# Altium project Portier_1730.PrjPcb
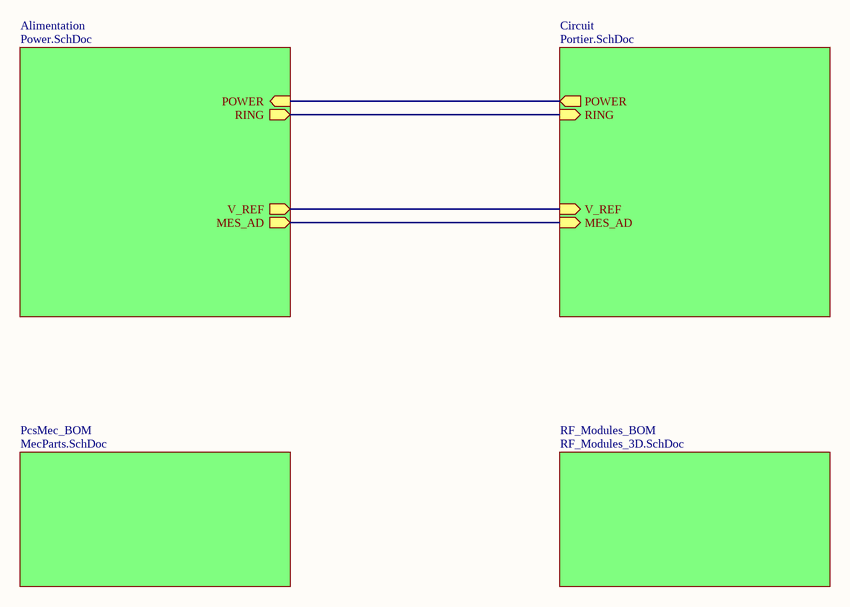
[diagram p0: TopSchematic.SchDoc]
5 sheets, 81 parts. Net scope: hierarchical (ports join the sheet entries above them; power ports are global).
Board file: Portier.PcbDoc
Sheets:
  TopSchematic.SchDoc
    Alimentation = Power.SchDoc
    Circuit = Portier.SchDoc
    PcsMec_BOM = MecParts.SchDoc
    RF_Modules_BOM = RF_Modules_3D.SchDoc

## Sheet TopSchematic.SchDoc: Top Schematic
size A4; Author: SCA/JMO; DrawnBy: IPE; Engineer: IPE; Address1: ETML-ES; Address2: Rue de Sébeillon 12; Address3: 1004 Lausanne; Revision: 17300C; SheetNumber: 3; SheetTotal: 3; Version: C; Modifc: Voir 17300_Portier-MOD-v_B.docx

### Sub-sheets
Alimentation = Power.SchDoc: RING (out), POWER (in), V_REF (out), MES_AD (out)
Circuit = Portier.SchDoc: MES_AD (in), V_REF (in), RING (in), POWER (out)
PcsMec_BOM = MecParts.SchDoc: no entries
RF_Modules_BOM = RF_Modules_3D.SchDoc: no entries

### Nets
NetC100_1: sheet Alimentation/RING, sheet Circuit/RING
NetC102_2: sheet Alimentation/V_REF, sheet Circuit/V_REF
NetQ102_1: sheet Alimentation/POWER, sheet Circuit/POWER
NetR103_1: sheet Alimentation/MES_AD, sheet Circuit/MES_AD

### Notes on the sheet
- Fichier :
- a
- Date :
- Heure :
- Version :
- Auteur :
- Modif.
- b
- c
- d
- Projet :
- No :
- Nb feuilles
- Feuille n°
- Chemin :

## Sheet Power.SchDoc: Power
size A4; Author: SCA/JMO; DrawnBy: IPE; Engineer: IPE; Address1: ETML-ES; Address2: Rue de Sébeillon 12; Address3: 1004 Lausanne; Revision: 17300C; SheetNumber: 1; SheetTotal: 3; Version: C; Modifc: Voir 17300_Portier-MOD-v_B.docx
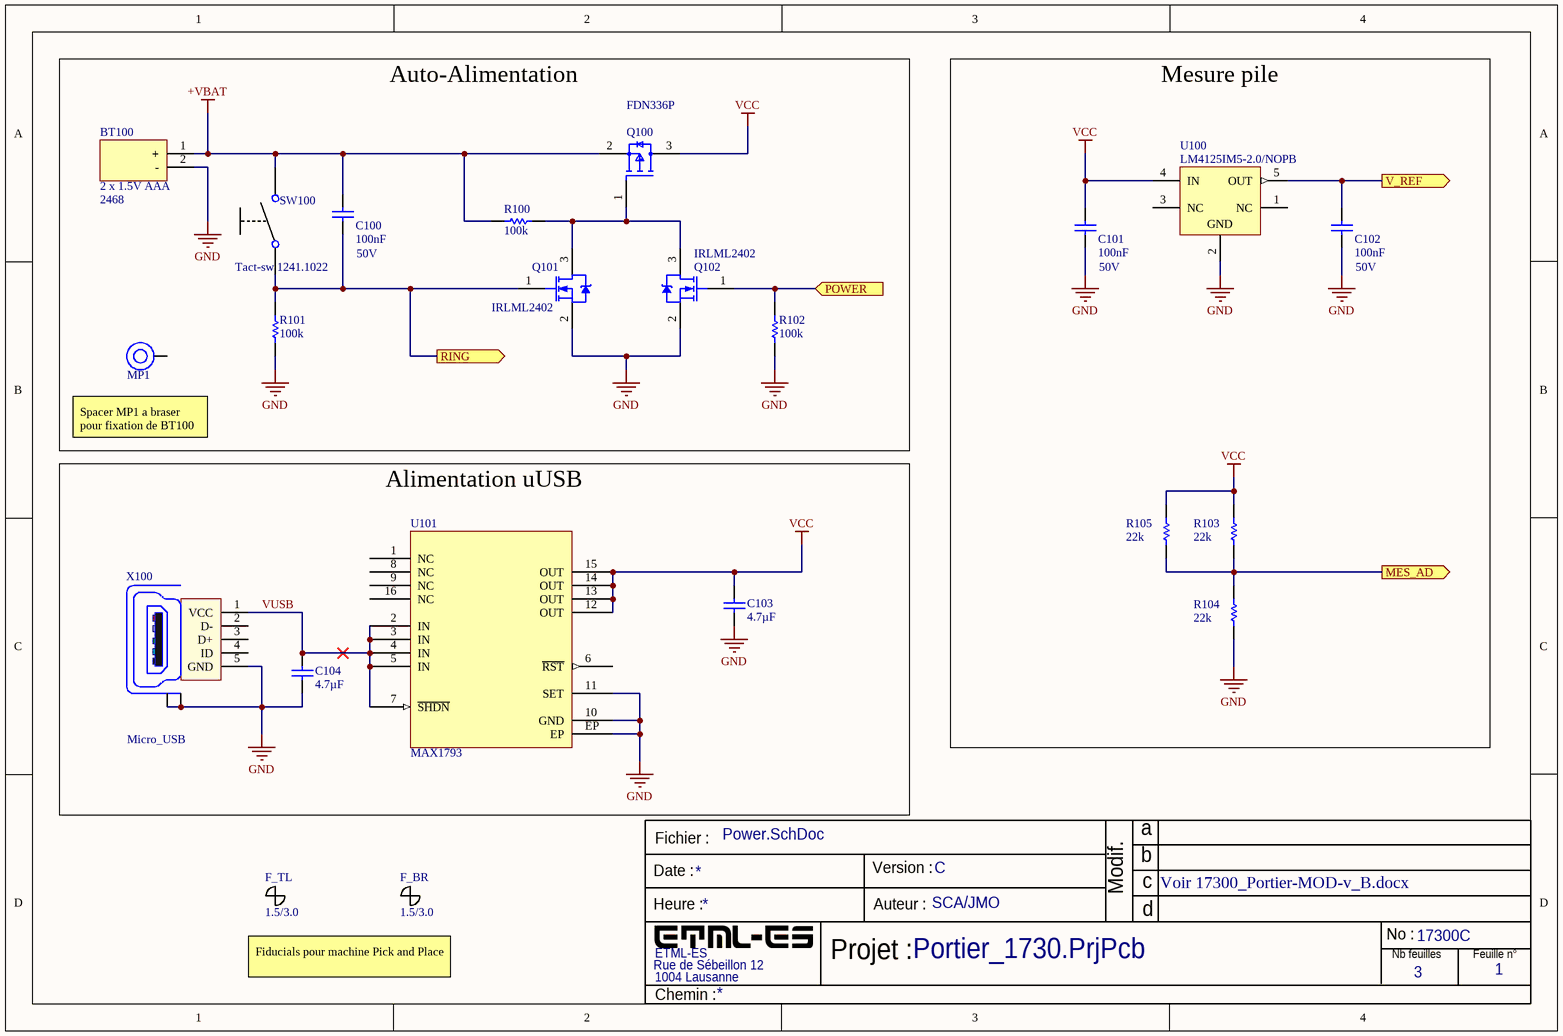
[diagram p1: Power.SchDoc]

### Parts
BT100  2 x 1.5V AAA  [2468_3D_Keystone]
C100  100nF  Rated Voltage (DC): 50V  [WCAP-CSGP_0805_L2W1.25H0.8_Reflow]
C101  100nF  Rated Voltage (DC): 50V  [WCAP-CSGP_0805_L2W1.25H0.8_Reflow]
C102  100nF  Rated Voltage (DC): 50V  [WCAP-CSGP_0805_L2W1.25H0.8_Reflow]
C103  4.7µF  [WCAP-CSGP_0805_L2W1.25H1.25]
C104  4.7µF  [WCAP-CSGP_0805_L2W1.25H1.25]
F_BR  1.5/3.0  [FID-150-300]  (no BOM)
F_TL  1.5/3.0  [FID-150-300]  (no BOM)
MP1  M3 x 3mm  [9774030360]  (value not drawn)
Q100  FDN336P  [FP-527AG-IPC_A]
Q101  IRLML2402  [INTR-IRLML2402TRPBF-3_V]
Q102  IRLML2402  [INTR-IRLML2402TRPBF-3_V]
R100  100k  [RESC2013X70X40ML20T20]
R101  100k  [RESC2013X70X40ML20T20]
R102  100k  [RESC2013X70X40ML20T20]
R103  22k  [RESC2013X50X30NL20T20]
R104  22k  [RESC2013X50X30NL20T20]
R105  22k  [RESC2013X50X30NL20T20]
SW100  Tact-sw 1241.1022  [Tact-sw 1241.1022]
U100  LM4125IM5-2.0/NOPB  [DBV0005A_M]
U101  MAX1793  [TSOP65P640X110_HS-17N]
X100  Micro_USB  [Micro_USB]

### Ports
MES_AD (out), POWER (in), RING (out), V_REF (out)

### Nets
+VBAT: BT100.1(+) C100.2 Q100.2(S) R100.2 SW100.2
GND: BT100.2(-) C101.1 C102.1 C103.1 C104.1 Q101.2(S) Q102.2(S) R101.1 R102.1 R104.1 U100.2(GND) U101.10(GND) U101.11(SET) U101.EP X100.5(GND) X100.Z1(Shield) X100.Z2(Shield)
VCC: C101.2 C103.2 Q100.3(D) R103.2 R105.2 U100.4(IN) U101.12(OUT) U101.13(OUT) U101.14(OUT) U101.15(OUT)
VUSB: C104.2 U101.2(IN) U101.3(IN) U101.4(IN) U101.5(IN) U101.7(~{SHDN}) X100.1(VCC)
NetC100_1: C100.1 Q101.1(G) R101.2 SW100.1 ; port RING
NetC102_2: C102.2 U100.5(OUT) ; port V_REF
NetQ100_1: Q100.1(G) Q101.3(D) Q102.3(D) R100.1
NetQ102_1: Q102.1(G) R102.2 ; port POWER
NetR103_1: R103.1 R104.2 R105.1 ; port MES_AD

Not connected (* = marked no-connect by the designer): MP1 1; U100 1(NC) 3(NC); U101 1(NC) 6(~{RST}) 8(NC) 9(NC) 16(NC); X100 2(D-) 3(D+) 4(ID)

### Notes on the sheet
- Auto-Alimentation
- (near MP1) Spacer MP1 a braser pour fixation de BT100
- Mesure pile
- Alimentation uUSB
- Fiducials pour machine Pick and Place
- Fichier :
- a
- Date :
- Heure :
- Version :
- Auteur :
- Modif.
- b
- c
- d
- Projet :
- No :
- Nb feuilles
- Feuille n°
- Chemin :

### Library data of the parts
BT100 = 2468: Cylindrical Battery Contacts, Clips, Holders & Springs 2AAA PC MNT HOLDER; Manufacturer_Name: Keystone Electronics; Manufacturer_Part_Number: 2468; Mouser Part Number: 534-2468; Mouser Price/Stock: https://www.mouser.co.uk/ProductDetail/Keystone-Electronics/2468?qs=3CbvriavsLAoISGi3MywrQ%3D%3D; Arrow Part Number: 2468; Arrow Price/Stock: http://www.arrow.com/en/products/2468/keystone-electronics-corp; Mouser Testing Part Number: *; Mouser Testing Price/Stock: *; Datasheet Link: https://datasheet.datasheetarchive.com/originals/distributors/Datasheets-AE/DSA3AE00005.pdf; Value: 2 x 1.5V AAA
C100-C102 = 885012207098: WCAP-CSGP Multilayer Ceramic Chip Capacitor, General Purpose, size 0805, X7R, 100nF, 50VDC; Manufacturer: Wurth Elektronik; Capacitance Tolerance: +/-10%; Case/Size Code: 0805; Dissipation Factor: 2.5%; Insulation Resistance: 5GΩ; Technical Reference: X7R0805104K050DFCT10000; Length: 2mm; ComponentLink1Description: Website Link; Width: 1.25mm; Capacitance: 100nF; ComponentLink1URL: https://www.we-online.com/redexpert/article/885012207098?ad; Mount: Surface Mount; ComponentLink2URL: https://www.we-online.com/redexpert/spec/885012207098?ad; ComponentLink2Description: Datasheet Link; Packaging: Tape and Reel; Height: 0.8mm; Category: Multilayer Ceramic Chip Capacitors; Ceramic Type: X7R; Manufacturer Part Number: 885012207098; Match Code: WCAP-CSGP; Operating Temperature Max: 125°C; Operating Temperature Min: -55°C
C103 C104 = 885012207053: WCAP-CSGP Multilayer Ceramic Chip Capacitor, General Purpose, size 0805, X7R, 4.7µF, 16VDC; PartNumber: GRM21BR61C475KA88L; Manufacturer: Wurth Elektronik; Tolerance: 10%; Voltage Rating (DC): 16 V; Capacitance Tolerance: +/-10%; Case/Size Code: 0805; Insulation Resistance: 0.02GΩ; Rated Voltage (DC): 16V; Technical Reference: X7R0805475K016DFCT10000; Value: 4.7µF 16V; DatasheetVersion: 03/2016; Width: 1.25mm; Capacitance: 4.7µF; Mount: Surface Mount; ComponentLink1Description: Website Link; Case Code (Metric): 2012; PackageDescription: 2-Pin Surface Mount Device, Body 2 x 1.25 mm; Height: 1.25mm; Voltage Rating: 16 V; Max Operating Temperature: 85 degC; Length: 2mm; ComponentLink1URL: https://www.we-online.com/redexpert/article/885012207053?ad; Mounting Technology: Surface Mount; Packaging: Tape and Reel; Min Operating Temperature: -55 degC; ComponentLink2Description: Datasheet Link; Case Code (Imperial): 0805; PackageReference: 0805; ComponentLink2URL: https://www.we-online.com/redexpert/spec/885012207053?ad; Category: Multilayer Ceramic Chip Capacitors; Ceramic Type: X7R; Dissipation Factor: 10%; Manufacturer Part Number: 885012207053; Match Code: WCAP-CSGP; Operating Temperature Max: 125°C; Operating Temperature Min: -55°C
F_BR F_TL = CMP-063-000021-1: FID 1.5/3.0; IsStocked: False; PN: PN-509779; SubCategory: Fiducials; Value: 1.5/3.0; Category: Others
MP1 = 9774030360: WA-SMSI SMT Steel Spacer with internal Thread, OD 6mm, M3 x 3mm; Manufacturer: Wurth Elektronik; Inside Diameter: 4.2mm; Surface: Tin; ComponentLink1Description: Website Link; ComponentLink1URL: https://www.we-online.com/redexpert/article/9774030360?ad; ComponentLink2Description: Datasheet Link; ComponentLink2URL: https://www.we-online.com/redexpert/spec/9774030360?ad; Manufacturer Part Number: 9774030360; Category: SMT Spacers; Match Code: WA-SMSI; Mount: Surface Mount; Operating Temperature Max: 150°C; Operating Temperature Min: -55°C; Packaging: Bulk; Height: 3mm; Material: Steel; Outside Diameter: 6mm; Thread Size: M3; Value: 9774030360
Q100 = CMP-07173-000103-1: MOSFET P-CH 20V 1.3A SSOT3; Voltage Rating (DC): -20V; Element Configuration: Single; Threshold Voltage: -900mV; Current Rating: -1.3A; Rds On Max: 200mR; Turn-Off Delay Time: 16ns; Input Capacitance: 330pF; Max Power Dissipation: 500mW; Rise Time: 12ns; Turn-On Delay Time: 7ns; Number of Elements: 1; Gate to Source Voltage (Vgs): 8V; Width: 1.4mm; Lead Free: Lead Free; Length: 2.92mm; Max Operating Temperature: 150°C; Mount: Surface Mount; Contact Plating: Tin; Radiation Hardening: No; Case/Package: TO-236-3; Weight: 0.03g; Drain to Source Breakdown Voltage: -20V; Continuous Drain Current (ID): 1.3A; Min Operating Temperature: -55°C; On-State Resistance: 200mR; Drain to Source Voltage (Vdss): 20V; Fall Time: 12ns; Drain to Source Resistance: 200mR; Package Quantity: 1; Power Dissipation: 500mW; Nominal Vgs: -900mV; Termination: SMD/SMT; Packaging: Tape and Reel; Number of Pins: 3; Dual Supply Voltage: -20V; REACH SVHC: No SVHC; Height: 0.94mm; Value: FDN336P
Q101 Q102 = CMP-2000-05155-1: HEXFET(R) Power MOSFET, N-Channel, 20 V, 1.2 A, 3-Pin SOT-23, RoHS, Tape and Reel; Manufacturer: Infineon Technologies; PartNumber: IRLML2402TRBF; Value: IRLML2402TRBF; PackageCase: SOT-23; Supplier: Digi-key,Stock ES; Supplier PN: IRLML2402PBFCT-ND; Supplier min. qty: 1; Supplier unit price: 0.34
R100-R102 = CMP-2001-04377-1: 100 kOhms ±1% 0.125W, 1/8W Chip Resistor 0805 (2012 Metric) Automotive AEC-Q200 Thick Film; Part Number: ERJ-6ENF1003V; Manufacturer: Panasonic; Value: 100k
R103-R105 = CMP-2001-03688-1: Manufacturer: Vishay Dale; Part Number: CRCW080522K0FKEA; Value: 22k
U100 = CMP-0074-00337-3: Precision Micropower Low Dropout Voltage Reference, 5-pin SOT-23, Pb-Free; Manufacturer: Texas Instruments; CompType: Voltage Reference IC; PowerWise: Y; PackageTopMarking: R80B*XTT; PackageVersion: revD, Aug-2008; DatasheetVersion: Nov-2003; RoHS: Y; ComponentLink1URL: http://www.ti.com/general/docs/lit/getliterature.tsp?genericPartNumber=LM4125&fileType=pdf; PackageReference: DBV0005A; PinCount: 5; PackageDescription: Molded SOT-23, .115 x .063 x .040 in Body, 5 Lead, .0375 in Pitch; ComponentLink1Description: Datasheet; RevisionNote: Component URLs added; Value: LM4125IM5-2.0
U101 = MAX1793: IC REG LINEAR POS ADJ 1A 16TSSOP; Manufacturer: Maxim Integrated; Value: MAX1793EUE33; Supplier: Stock ES
X100 = WR-Communication Connectors 629105150521: WR-COM_USB_Micro Type B_Horizontal_SMT; Manufacturer: Würth Elektronik eiSos GmbH; Voltage Rating: 5V; PartNumber: 629105150521; Supplier: Digi-key; Supplier PN: 732-5960-1-ND; Supplier min. qty: 1; Supplier unit price: 2.03; Supplier 1: Digi-Key; Supplier Part Number 1: 732-5960-1-ND

## Sheet Portier.SchDoc: Montage OUT
size A4; Author: SCA/JMO; DrawnBy: IPE; Engineer: IPE; Address1: ETML-ES; Address2: Rue de Sébeillon 12; Address3: 1004 Lausanne; Revision: 17300C; SheetNumber: 2; SheetTotal: 3; Version: C; SPICEModelCacheKMTVROIH: <root> / <DocumentId>KMTVROIH</DocumentId> / <CacheFrame Number="0"> / <Model Name="0805_150080vs75000" Kind="CKT"> / <Text>****** / .subckt 0805_150080VS75000  1  2 / D1 1 2 SMCW / .MODEL SMCW D / + IS=10.000E-21 / + N=1.8458 / + RS=1.0082 / + IKF=6.4818 / + CJO=1.0000E-12 / + M=.3333 / + VJ=.75 / + BV=5 / + IBV=10.00E-6 / + TT=5.0000E-9 / .ends</Text> / </Model> / <Model Name="0805_885012107014_10uf" Kind="CKT"> / <Text>******* / .subckt 0805_885012107014_10uF 1 2 / Rser 1 3 0.0034022396539 / Lser 2 4 3.00259834E-10 / C1 3 4 0.00001 / Rpar 3 4 5000000 / .ends 0805_885012107014_10uF</Text> / </Model> / </CacheFrame> / </root>; Modifc: Voir 17300_Portier-MOD-v_B.docx
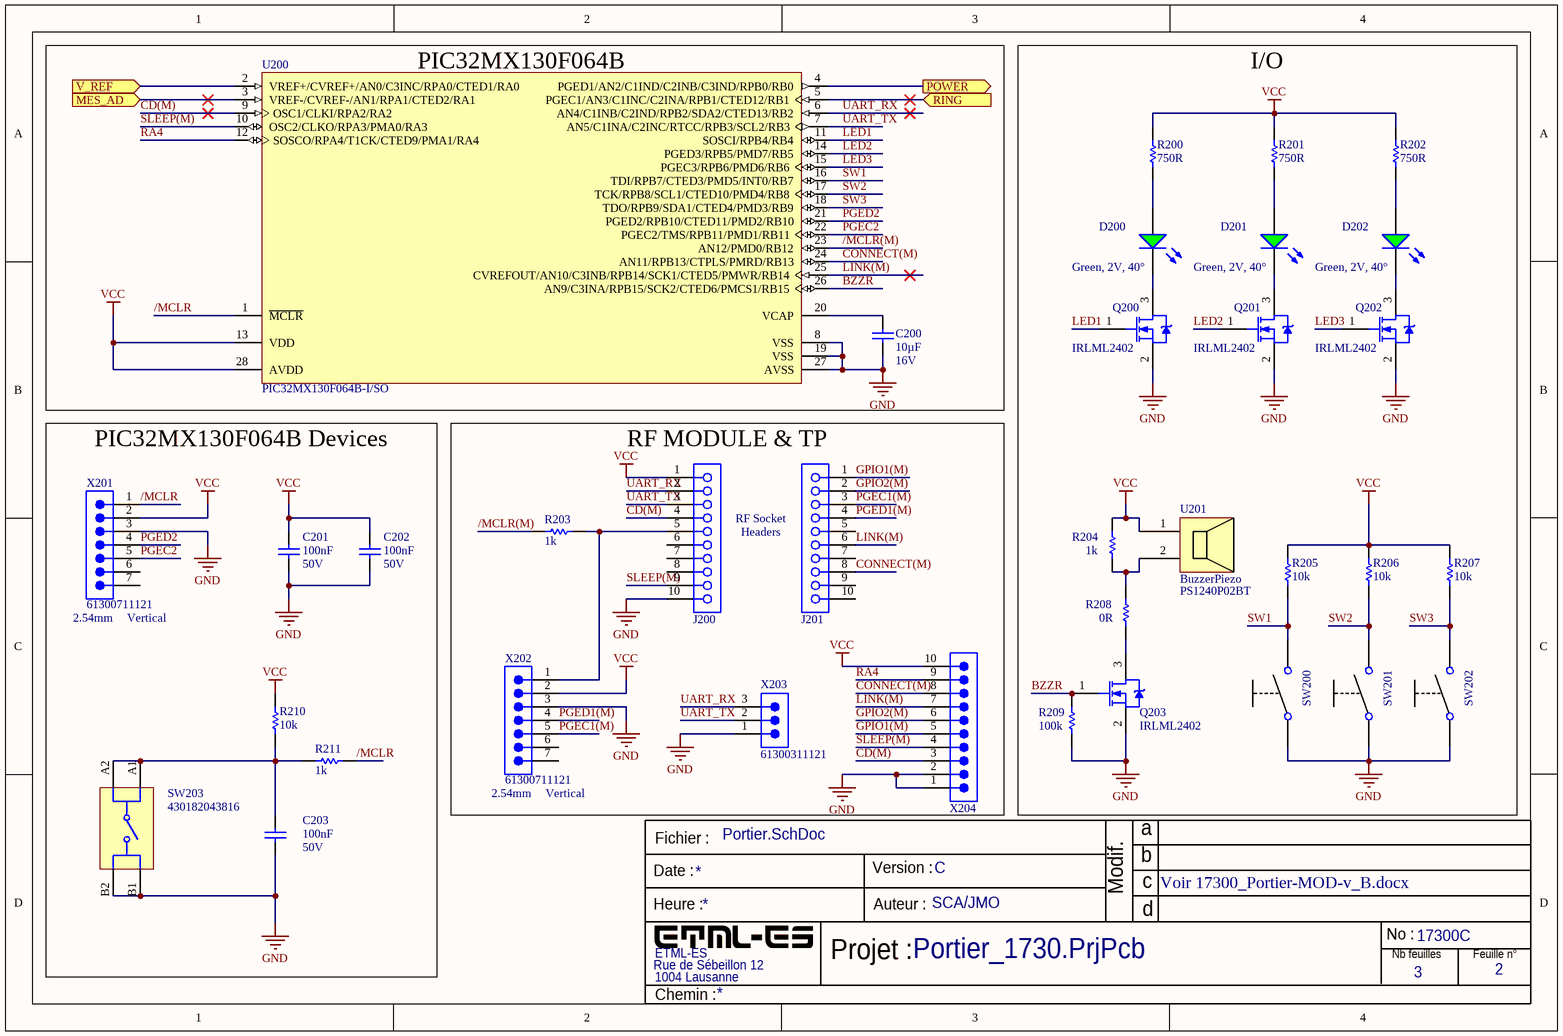
[diagram p2: Portier.SchDoc]

### Parts
C200  10µF  Rated Voltage (DC): 16V  [WCAP-CSGP_0805_L2W1.25H1.25]
C201  100nF  Rated Voltage (DC): 50V  [WCAP-CSGP_0805_L2W1.25H0.8_Reflow]
C202  100nF  Rated Voltage (DC): 50V  [WCAP-CSGP_0805_L2W1.25H0.8_Reflow]
C203  100nF  Rated Voltage (DC): 50V  [WCAP-CSGP_0805_L2W1.25H0.8_Reflow]
D200  Green, 2V, 40°  [WL-SMCW_0805_150080xx75000]
D201  Green, 2V, 40°  [WL-SMCW_0805_150080xx75000]
D202  Green, 2V, 40°  [WL-SMCW_0805_150080xx75000]
J200  62001011821  [62001011821]  (value not drawn)
J201  62001011821  [62001011821]  (value not drawn)
Q200  IRLML2402  [INTR-IRLML2402TRPBF-3_V]
Q201  IRLML2402  [INTR-IRLML2402TRPBF-3_V]
Q202  IRLML2402  [INTR-IRLML2402TRPBF-3_V]
Q203  IRLML2402  [INTR-IRLML2402TRPBF-3_V]
R200  750R  [RESC2013X50X30NL20T20]
R201  750R  [RESC2013X50X30NL20T20]
R202  750R  [RESC2013X50X30NL20T20]
R203  1k  [RESC2013X50X30ML20T20]
R204  1k  [RESC2013X50X30ML20T20]
R205  10k  [RESC2013X60X35NL10T20]
R206  10k  [RESC2013X60X35NL10T20]
R207  10k  [RESC2013X60X35NL10T20]
R208  0R  [RESC2013X60X35ML10T20]
R209  100k  [RESC2013X70X40ML20T20]
R210  10k  [RESC2013X60X35NL10T20]
R211  1k  [RESC2013X50X30ML20T20]
SW200  Tact-sw 1241.1022  [Tact-sw 1241.1022]  (value not drawn)
SW201  Tact-sw 1241.1022  [Tact-sw 1241.1022]  (value not drawn)
SW202  Tact-sw 1241.1022  [Tact-sw 1241.1022]  (value not drawn)
SW203  430182043816  [WS-TASV_L6W6H4.3_4301x20438x6]
U200  PIC32MX130F064B-I/SO  [MCHP-SOIC-SO28_M]
U201  BuzzerPiezo  value PS1240P02BT  [Buzzer]
X201  61300711121  Orientation: Vertical  Pitch: 2.54mm  [61300711121]
X202  61300711121  Orientation: Vertical  Pitch: 2.54mm  [61300711121]
X203  61300311121  [61300311121]
X204  61301011121  [61301011121]  (value not drawn)

### Ports
MES_AD (in), POWER (out), RING (in), V_REF (in)

### Nets
GND: C200.2 C201.1 C202.1 C203.1 J200.10 Q200.2(S) Q201.2(S) Q202.2(S) Q203.2(S) R209.1 SW200.1 SW201.1 SW202.1 SW203.B1 SW203.B2 U200.8(VSS) U200.19(VSS) U200.27(AVSS) X201.3 X202.3 X203.1 X204.1 X204.2
VCC: C201.2 C202.2 J200.1 R200.1 R201.1 R202.2 R204.2 R205.2 R206.2 R207.2 R210.1 U200.13(VDD) U200.28(AVDD) U201.1 X201.2 X202.2 X204.10
/MCLR: R211.2 U200.1(~{MCLR}) X201.1
/MCLR(M): R203.2 U200.23(AN12/PMD0/RB12)
BZZR: Q203.1(G) R209.2 U200.26(AN9/C3INA/RPB15/SCK2/CTED6/PMCS1/RB15)
CD(M): J200.4 U200.9(OSC1/CLKI/RPA2/RA2) X204.3
CONNECT(M): J201.8 U200.24(AN11/RPB13/CTPLS/PMRD/RB13) X204.8
GPIO1(M): J201.1 X204.5
GPIO2(M): J201.2 X204.6
LED1: Q200.1(G) U200.11(SOSCI/RPB4/RB4)
LED2: Q201.1(G) U200.14(PGED3/RPB5/PMD7/RB5)
LED3: Q202.1(G) U200.15(PGEC3/RPB6/PMD6/RB6)
LINK(M): J201.6 U200.25(CVREFOUT/AN10/C3INB/RPB14/SCK1/CTED5/PMWR/RB14) X204.7
PGEC1(M): J201.3 X202.5
PGEC2: U200.22(PGEC2/TMS/RPB11/PMD1/RB11) X201.5
PGED1(M): J201.4 X202.4
PGED2: U200.21(PGED2/RPB10/CTED11/PMD2/RB10) X201.4
RA4: U200.12(SOSCO/RPA4/T1CK/CTED9/PMA1/RA4) X204.9
SLEEP(M): J200.9 U200.10(OSC2/CLKO/RPA3/PMA0/RA3) X204.4
SW1: R205.1 SW200.2 U200.16(TDI/RPB7/CTED3/PMD5/INT0/RB7)
SW2: R206.1 SW201.2 U200.17(TCK/RPB8/SCL1/CTED10/PMD4/RB8)
SW3: R207.1 SW202.2 U200.18(TDO/RPB9/SDA1/CTED4/PMD3/RB9)
UART_RX: J200.2 U200.6(AN4/C1INB/C2IND/RPB2/SDA2/CTED13/RB2) X203.3
UART_TX: J200.3 U200.7(AN5/C1INA/C2INC/RTCC/RPB3/SCL2/RB3) X203.2
NetC100_1: U200.5(PGEC1/AN3/C1INC/C2INA/RPB1/CTED12/RB1) ; port RING
NetC102_2: U200.2(VREF+/CVREF+/AN0/C3INC/RPA0/CTED1/RA0) ; port V_REF
NetC200_1: C200.1 U200.20(VCAP)
NetC203_2: C203.2 R210.2 R211.1 SW203.A1 SW203.A2
NetD200_1: D200.1(K) Q200.3(D)
NetD200_2: D200.2(A) R200.2
NetD201_1: D201.1(K) Q201.3(D)
NetD201_2: D201.2(A) R201.2
NetD202_1: D202.1(K) Q202.3(D)
NetD202_2: D202.2(A) R202.1
NetJ200_5: J200.5 R203.1 X202.1
NetQ102_1: U200.4(PGED1/AN2/C1IND/C2INB/C3IND/RPB0/RB0) ; port POWER
NetQ203_3: Q203.3(D) R208.1
NetR103_1: U200.3(VREF-/CVREF-/AN1/RPA1/CTED2/RA1) ; port MES_AD
NetR204_1: R204.1 R208.2 U201.2

Not connected (* = marked no-connect by the designer): J200 6 7 8; J201 5 7 9 10; X201 6 7; X202 6 7

### Notes on the sheet
- PIC32MX130F064B
- RF Socket
- Headers
- RF MODULE & TP
- I/O
- PIC32MX130F064B Devices
- Fichier :
- a
- Date :
- Heure :
- Version :
- Auteur :
- Modif.
- b
- c
- d
- Projet :
- No :
- Nb feuilles
- Feuille n°
- Chemin :

### Library data of the parts
C200 = 885012107014: WCAP-CSGP Multilayer Ceramic Chip Capacitor, General Purpose, size 0805, X5R, 10µF, 16VDC; Manufacturer: Wurth Elektronik; Case/Size Code: 0805; Capacitance Tolerance: +/-20%; Dissipation Factor: 10%; Insulation Resistance: 0.01GΩ; Technical Reference: X5R0805106M016DFCT10000; Value: 10uF 16V; Manufacturer Part Number: 885012107014; Category: Multilayer Ceramic Chip Capacitors; Match Code: WCAP-CSGP; ComponentLink1Description: Website Link; ComponentLink1URL: https://www.we-online.com/redexpert/article/885012107014?ad; ComponentLink2Description: Datasheet Link; ComponentLink2URL: https://www.we-online.com/redexpert/spec/885012107014?ad; Mount: Surface Mount; Operating Temperature Max: 85°C; Operating Temperature Min: -55°C; Packaging: Tape and Reel; Length: 2mm; Width: 1.25mm; Height: 1.25mm; Capacitance: 10µF; Ceramic Type: X5R; Supplier 1: Rs; Supplier Part Number 1: 1813526
C201-C203 = 885012207098: as C100 on sheet Power; Length: 2mm; ComponentLink1Description: Website Link; Width: 1.25mm; Capacitance: 100nF; ComponentLink1URL: https://www.we-online.com/redexpert/article/885012207098?ad; Mount: Surface Mount; ComponentLink2URL: https://www.we-online.com/redexpert/spec/885012207098?ad; ComponentLink2Description: Datasheet Link; Packaging: Tape and Reel; Height: 0.8mm; Category: Multilayer Ceramic Chip Capacitors; Ceramic Type: X7R; Manufacturer Part Number: 885012207098; Match Code: WCAP-CSGP; Operating Temperature Max: 125°C; Operating Temperature Min: -55°C
D200-D202 = 150080VS75000: WL-SMCW Mono-color Chip LED Waterclear, size 0805, Bright Green, 2V, 140°; Manufacturer: Wurth Elektronik; Case/Size Code: 0805; Chip Technology: AlInGaP; Dominant Wavelength: 570nm; Luminous Intensity: 40mcd; Peak Wavelength: 572nm; Manufacturer Part Number: 150080VS75000; Category: Signal LEDs; Match Code: WL-SMCW; ComponentLink1Description: Website Link; ComponentLink1URL: https://www.we-online.com/redexpert/article/150080VS75000?ad; ComponentLink2Description: Datasheet Link; ComponentLink2URL: https://www.we-online.com/redexpert/spec/150080VS75000?ad; Mount: Surface Mount; Operating Temperature Max: 85°C; Operating Temperature Min: -40°C; Packaging: Tape and Reel; Length: 2mm; Width: 1.25mm; Height: 0.7mm; Emitting Color: Bright Green; Forward Voltage: 2V; Viewing Angle: 140°; Supplier 1: Digi-Key; Supplier Part Number 1: 732-4986-1-ND; Supplier 2: Mouser; Supplier Part Number 2: 710-150080VS75000
J200 J201 = 62001011821: WR-PHD Socket Header, THT, Vertical, pitch 2mm, 1 Row, 10P; Manufacturer: Wurth Elektronik; Contact Resistance: 20mΩ; Rated Current: 2A; Working Voltage: 250V; Withstanding Voltage: 500V; Value: HD 10x1 2mm; ComponentLink1Description: Website Link; ComponentLink1URL: https://www.we-online.com/redexpert/article/62001011821?ad; ComponentLink2Description: Datasheet Link; ComponentLink2URL: https://www.we-online.com/redexpert/spec/62001011821?ad; Manufacturer Part Number: 62001011821; Category: Board-to-Board Connectors; Match Code: WR-PHD; Mount: Through Hole; Operating Temperature Max: 105°C; Operating Temperature Min: -40°C; Packaging: Tube; Gender: Socket Header; Number of Pins: 10; Number of Rows: 1; Orientation: Vertical; Pitch: 2mm
Q200-Q203 = CMP-2000-05155-1: as Q101 on sheet Power; PackageCase: SOT-23; Supplier: Digi-key,Stock ES; Supplier PN: IRLML2402PBFCT-ND; Supplier min. qty: 1; Supplier unit price: 0.34
R200-R202 = CMP-2001-04102-1: 750 ohm, 0.125W, 1%., 0805; Manufacturer: Vishay Dale; Part Number: CRCW0805750KFKEA
R203 R204 R211 = CMP-1013-00510-2: Part Number: CRCW08051K00FKEA; Manufacturer: Vishay Dale; Value: 1k
R205-R207 R210 = CMP-1659-00013-4: Chip Resistor, 10 KOhm, +/- 1%, 0.125 W, -55 to 155 degC, 0805 (2012 Metric), RoHS, Tape and Reel; Voltage Rating: 150 V; PackageCase: 0805; Value: 10k; Supplier: Stock ES
R208 = CMP-2000-06963-1: Chip Resistor, 0 Ohm, +/- 5%, 125 mW, -55 to 155 degC, 0805 (2012 Metric), RoHS, Tape and Reel; Manufacturer: Yageo; Product Length (mm): 2mm; Tolerance (+ or -): NotRequired; Case Style: Molded; Product Height (mm): 0.5mm; Power Rating(s): NotRequiredW; Product Depth (mm): 1.25mm; Mounting Technology: SurfaceMount; Military Standard: NotRequired; Operating Temp Range: -55Cto155C; Temperature Coefficient: NotRequired; Package Description: 2-Pin Surface Mounted Device, Body 2 x 1.25 mm; Datasheet Version: Rev. 7, 05/2017; Failure Rate: NotRequired; Manufacturer URL: http://www.yageo.com/; Datasheet URL: http://www.yageo.com/documents/recent/PYu-RC_Group_51_RoHS_L_7.pdf; Packaging: TapeandReel; Package Reference: 0805; Package / Case: 0805; Termination Style: NotRequired; Type: ThickFilm; Construction: Rectangular; Value: 0R
R209 = CMP-2001-04377-1: as R100 on sheet Power; Value: 100k
SW203 = 430182043816: WS-TASV SMT Tact Switch, L6 x W6 x H4.3mm, 160g, SPST-NO, 12V, 50mA; Manufacturer: Wurth Elektronik; Washable: No; Manufacturer Part Number: 430182043816; Category: Tact Switches; Match Code: WS-TASV; ComponentLink1Description: Website Link; ComponentLink1URL: https://www.we-online.com/redexpert/article/430182043816?ad; ComponentLink2Description: Datasheet Link; ComponentLink2URL: https://www.we-online.com/redexpert/spec/430182043816?ad; Mount: Surface Mount; Operating Temperature Max: 85°C; Operating Temperature Min: -40°C; Packaging: Tape and Reel; Length: 6mm; Width: 6mm; Height: 4.3mm; Circuit: SPST-NO; Contact Material: Stainless Steel; Contact Plating: Silver; Operation Force: 160g; Rated Current: 50mA; Rated Voltage (DC): 12V; Terminal Material: Copper Alloy; Terminal Plating: Silver; Value: 430182043816
U200 = CMP-0048-00454-1: 32-bit Microcontroller with Audio and Graphics Interface, USB and Advanced Analog, 40 MHz, 21 I/O, PMP, -40 to 85 degC, 28-pin SOIC (SO28), Tube; Manufacturer: Microchip; ComponentLink4URL: http://www.microchip.com/PIC32MX130F064B; DatasheetVersion: Rev. E; ComponentLink1URL: http://www.microchip.com; ComponentLink2URL: http://ww1.microchip.com/downloads/en/DeviceDoc/61168E.pdf; PackageDescription: 28-Lead Plastic Small Outline, 17.9 x 7.5 mm Body, 1.27 mm Pitch; PackageVersion: C04-052C; Mounting Technology: Surface Mount; ComponentLink2Description: Datasheet; ComponentLink3URL: http://www.microchip.com/stellent/groups/techpub_sg/documents/packagingspec/en012702.pdf; PartNumber: PIC32MX130F064B-I/SO; PackageReference: SOIC-SO28; ComponentLink1Description: Manufacturer URL; ComponentLink3Description: Package Specification; ComponentLink4Description: Product URL; Supplier: Digi-key; Supplier PN: PIC32MX130F064B-I/SO-ND; Value: PIC32MX130F064B-I/SO
U201 = BZR: Buzzer 12mm piezo; Manufacturer: TDK Corporation; PartNumber: PS1240P02BT; Supplier: Digi-key; Supplier PN: 445-2525-1-ND; Supplier min. qty: 1; Supplier unit price: 0.67
X201 X202 = 61300711121: WR-PHD Pin Header, THT, Vertical, pitch 2.54mm, 1 Row, 7P; Manufacturer: Wurth Elektronik; Contact Resistance: 20mΩ; Rated Current: 3A; Working Voltage: 250V; Withstanding Voltage: 500V; Value: HD 7x1 2.54mm; ComponentLink1Description: Website Link; ComponentLink1URL: https://www.we-online.com/redexpert/article/61300711121?ad; ComponentLink2Description: Datasheet Link; ComponentLink2URL: https://www.we-online.com/redexpert/spec/61300711121?ad; Manufacturer Part Number: 61300711121; Category: Board-to-Board Connectors; Match Code: WR-PHD; Mount: Through Hole; Operating Temperature Max: 105°C; Operating Temperature Min: -40°C; Packaging: Bag; Gender: Pin Header; Number of Pins: 7; Number of Rows: 1
X203 = 61300311121: WR-PHD Pin Header, THT, Vertical, pitch 2.54mm, 1 Row, 3P; Manufacturer: Wurth Elektronik; Contact Resistance: 20mΩ; Rated Current: 3A; Working Voltage: 250V; Withstanding Voltage: 500V; Value: HD 3x1 2.54mm; ComponentLink1Description: Website Link; ComponentLink1URL: https://www.we-online.com/redexpert/article/61300311121?ad; ComponentLink2Description: Datasheet Link; ComponentLink2URL: https://www.we-online.com/redexpert/spec/61300311121?ad; Manufacturer Part Number: 61300311121; Category: Board-to-Board Connectors; Match Code: WR-PHD; Mount: Through Hole; Operating Temperature Max: 105°C; Operating Temperature Min: -40°C; Packaging: Bag; Gender: Pin Header; Number of Pins: 3; Number of Rows: 1; Orientation: Vertical; Pitch: 2.54mm
X204 = 61301011121: WR-PHD Pin Header, THT, Vertical, pitch 2.54mm, 1 Row, 10P; Manufacturer: Wurth Elektronik; Contact Resistance: 20mΩ; Rated Current: 3A; Working Voltage: 250V; Withstanding Voltage: 500V; Value: HD 10x1 2.54mm; ComponentLink1Description: Website Link; ComponentLink1URL: https://www.we-online.com/redexpert/article/61301011121?ad; ComponentLink2Description: Datasheet Link; ComponentLink2URL: https://www.we-online.com/redexpert/spec/61301011121?ad; Manufacturer Part Number: 61301011121; Category: Board-to-Board Connectors; Match Code: WR-PHD; Mount: Through Hole; Operating Temperature Max: 105°C; Operating Temperature Min: -40°C; Packaging: Bag; Gender: Pin Header; Number of Pins: 10; Number of Rows: 1; Orientation: Vertical; Pitch: 2.54mm

## Sheet MecParts.SchDoc: =SchTitle
size A4; Author: JMO; Organization: ETML; Address1: Rue de Sébeillon12; Address2: CH - 1004 Lausanne; Address3: Tél. 021 316 77 77; Address4: www.etml.ch; Revision: 17300C; SheetNumber: 4; SheetTotal: 5; Replace: .; Modifa: Schéma initial  en version C; ModB: .; ModC: .; ModD: .; SPICEModelCacheLYDHXSVX: <root> / <DocumentId>LYDHXSVX</DocumentId> / </root>; Version: C
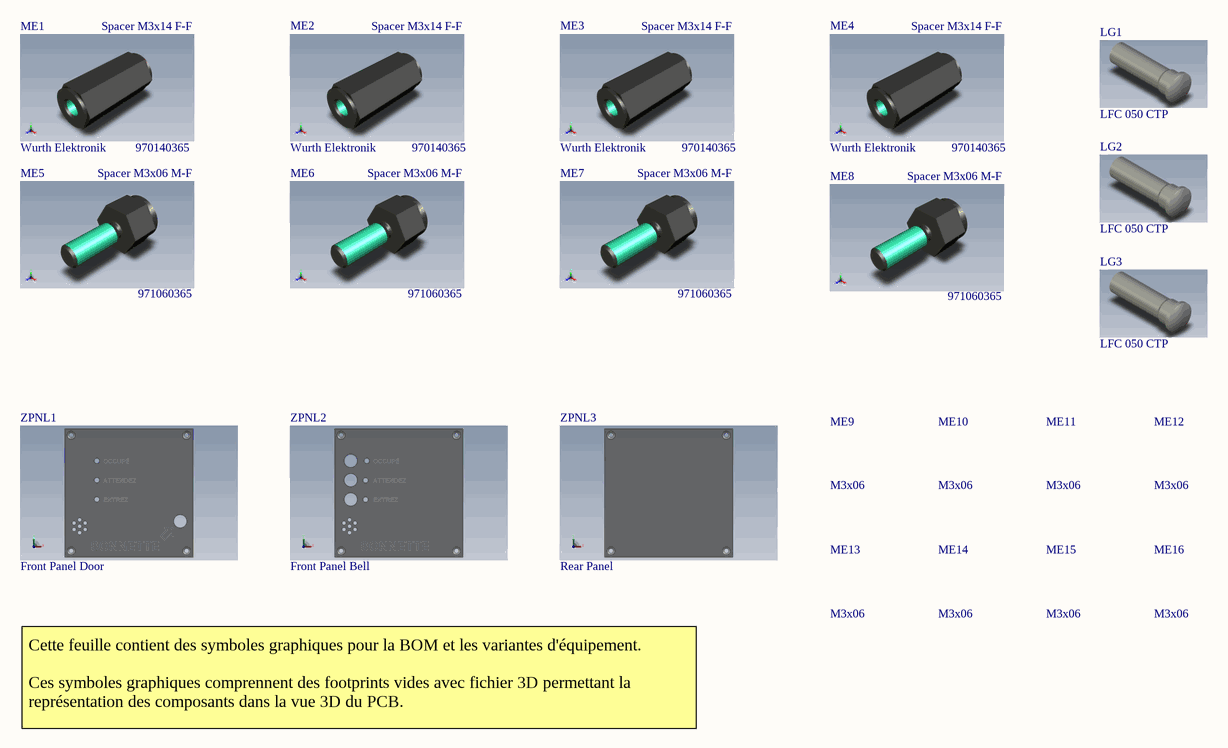
[diagram p3: MecParts.SchDoc]

### Parts
LG1  LFC 050 CTP  [Light Guide LFC050]
LG2  LFC 050 CTP  [Light Guide LFC050]
LG3  LFC 050 CTP  [Light Guide LFC050]
ME1  Spacer M3x14 F-F  Manufacturer: Wurth Elektronik  Manufacturer Part Number: 970140365  [M3x14_FF_970140365]
ME2  Spacer M3x14 F-F  Manufacturer: Wurth Elektronik  Manufacturer Part Number: 970140365  [M3x14_FF_970140365]
ME3  Spacer M3x14 F-F  Manufacturer: Wurth Elektronik  Manufacturer Part Number: 970140365  [M3x14_FF_970140365]
ME4  Spacer M3x14 F-F  Manufacturer: Wurth Elektronik  Manufacturer Part Number: 970140365  [M3x14_FF_970140365]
ME5  Spacer M3x06 M-F  Manufacturer Part Number: 971060365  [M3X06_MF_971060365]
ME6  Spacer M3x06 M-F  Manufacturer Part Number: 971060365  [M3X06_MF_971060365]
ME7  Spacer M3x06 M-F  Manufacturer Part Number: 971060365  [M3X06_MF_971060365]
ME8  Spacer M3x06 M-F  Manufacturer Part Number: 971060365  [M3X06_MF_971060365]
ME9  M3x06  [M3x06 Screw Height_16]
ME10  M3x06  [M3x06 Screw Height_16]
ME11  M3x06  [M3x06 Screw Height_16]
ME12  M3x06  [M3x06 Screw Height_16]
ME13  M3x06  [M3x06 Screw Height_8]
ME14  M3x06  [M3x06 Screw Height_8]
ME15  M3x06  [M3x06 Screw Height_8]
ME16  M3x06  [M3x06 Screw Height_8]
ZPNL1  Front Panel Door  [Face AV Door]
ZPNL2  Front Panel Bell  [Face avant Bell]
ZPNL3  Rear Panel  [Face Arriere]

### Notes on the sheet
- Cette feuille contient des symboles graphiques pour la BOM et les variantes d'équipement.
  Ces symboles graphiques comprennent des footprints vides avec fichier 3D permettant la représentation des composants dans la vue 3D du PCB.
- Fichier :
- a
- Date :
- Heure :
- Version :
- Auteur :
- Modif.
- b
- c
- d
- Projet :
- No :
- Nb feuilles
- Feuille n°
- Chemin :

### Library data of the parts
LG1-LG3 = LightPipe LFC050CTP: Light Guide pour panneau pour Leds
ME1-ME4 = Spacer M3x14 F-F: Hexagonal Plastic Spacer Stud, M3x14 F-F; Inner Thread: M3; Inner Thread Length: 14; Wrench: 6; Length: 14
ME5-ME8 = Spacer M3x06 M-F: Hexagonal Plastic Spacer Stud, M3x06 M-F; Manufacturer: Wurth Elektronik; Inner Thread: M3; Inner Thread Length: 3; Outer Thread Length: 8; Wrench: 6; Length: 5; Outer Thread: M3
ME9-ME16 = M3x06 Countersunk: M3x06 Coutersunk screw
ZPNL1 = Panel Face Avant (Door): Panneau de face avant de porte (Portier electronique)
ZPNL2 = Panel Face Avant (Bell): Panneau de face avant de porte (Portier electronique)
ZPNL3 = Panel Face Arriere: Panneau de face arriere de porte (Portier electronique)

## Sheet RF_Modules_3D.SchDoc
size A4; Author: JMO; Address1: ETML-ES; Address2: Rue Sébeillon 12; Address3: 1004 Lausanne; Revision: 1730C; SheetNumber: 5; SheetTotal: 5; Version: C; Modifa: Schéma initial pour version C
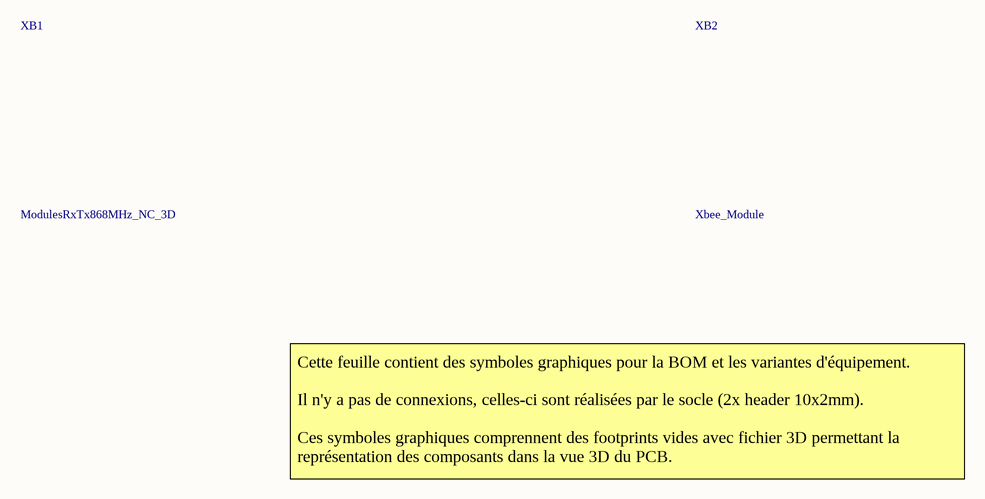
[diagram p4: RF_Modules_3D.SchDoc]

### Parts
XB1  ModulesRxTx868MHz_NC_3D  [ModulesRxTx868MHz_1623]
XB2  Xbee_Module  [Xbee_3D]

### Notes on the sheet
- Cette feuille contient des symboles graphiques pour la BOM et les variantes d'équipement.
  Il n'y a pas de connexions, celles-ci sont réalisées par le socle (2x header 10x2mm).
  Ces symboles graphiques comprennent des footprints vides avec fichier 3D permettant la représentation des composants dans la vue 3D du PCB.
- Fichier :
- a
- Date :
- Heure :
- Version :
- Auteur :
- Modif.
- b
- c
- d
- Projet :
- No :
- Nb feuilles
- Feuille n°
- Chemin :

### Library data of the parts
XB1 = ModulesRxTx868MHz_Empty: 2x Header 2x10 2mm / compatible xBee - sans connexion, avec footprint; PackageCase: XBee; Value: 2x10; Supplier: Digi-key; Supplier PN: 2x 3M156413-10-ND; Supplier min. qty: 1; Supplier unit price: 2x 0.74
XB2 = Xbee_Module: Module Xbee 3D pour BOM et représentation 3D

## Nets that join several sheets
GND: Power (17 pins), Portier (23 pins)
VCC: Power (10 pins), Portier (17 pins)
NetC100_1: Power (C100.1 Q101.1 R101.2 SW100.1), Portier (U200.5)
NetC102_2: Power (C102.2 U100.5), Portier (U200.2)
NetQ102_1: Power (Q102.1 R102.2), Portier (U200.4)
NetR103_1: Power (R103.1 R104.2 R105.1), Portier (U200.3)

## Assembly variants
PCBA_Door: not fitted C103 C104 LG1 LG2 LG3 ME1 ME2 ME3 ME4 ME5 ME6 ME7 ME8 ME9 ME10 ME11 ME12 ME13 ME14 ME15 ME16 SW200 SW201 SW202 U101 X100 XB1 XB2 ZPNL1 ZPNL2 ZPNL3
PCBA_Bell: not fitted BT100 C100 C101 C102 LG1 LG2 LG3 ME1 ME2 ME3 ME4 ME5 ME6 ME7 ME8 ME9 ME10 ME11 ME12 ME13 ME14 ME15 ME16 MP1 Q100 Q101 Q102 R100 R101 R102 R103 R105 SW100 U100 XB1 XB2 ZPNL1 ZPNL2 ZPNL3
MEC_Assy_Door: not fitted C103 C104 SW200 SW201 SW202 U101 X100 XB2 ZPNL2
MEC_Assy_Bell: not fitted BT100 C100 C101 C102 MP1 Q100 Q101 Q102 R100 R101 R102 R103 R105 SW100 U100 XB1 ZPNL1